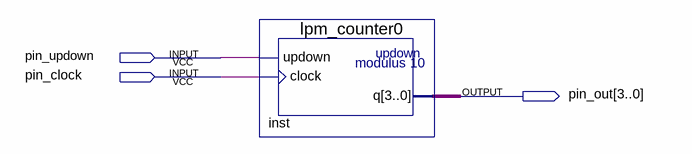
[diagram p0: schematic sheet]
// Quartus schematic counter.bdf as structural Verilog: 1 symbols, 3 pins
module counter (
  input  pin_updown,
  input  pin_clock,
  output [3:0] pin_out
);

  lpm_counter0 inst (.updown(pin_updown), .clock(pin_clock), .q(pin_out));
endmodule
